# Altium schematic sheet AFE_Buffer.SchDoc: Shuttler
size 420 x 297 mm; Author: G.Kasprowicz; CompanyName: WUT ISE; DrawnBy: G.Kasprowicz; Organization: WUT ISE; Address1: PW ISE; Address2: Nowowiejska 15/19 00-665 Warsaw; Address3: gkasprow@gmail.com; DocumentNumber: 2; SheetNumber: 2; SheetTotal: 10; ModifiedBy: -; CheckedDate: -; Title2: AFE control buffers; DivGrp: WUT ISE; Designer: G.Kasprowicz; ModifiedDate: -; ProjectName: Sensor Box
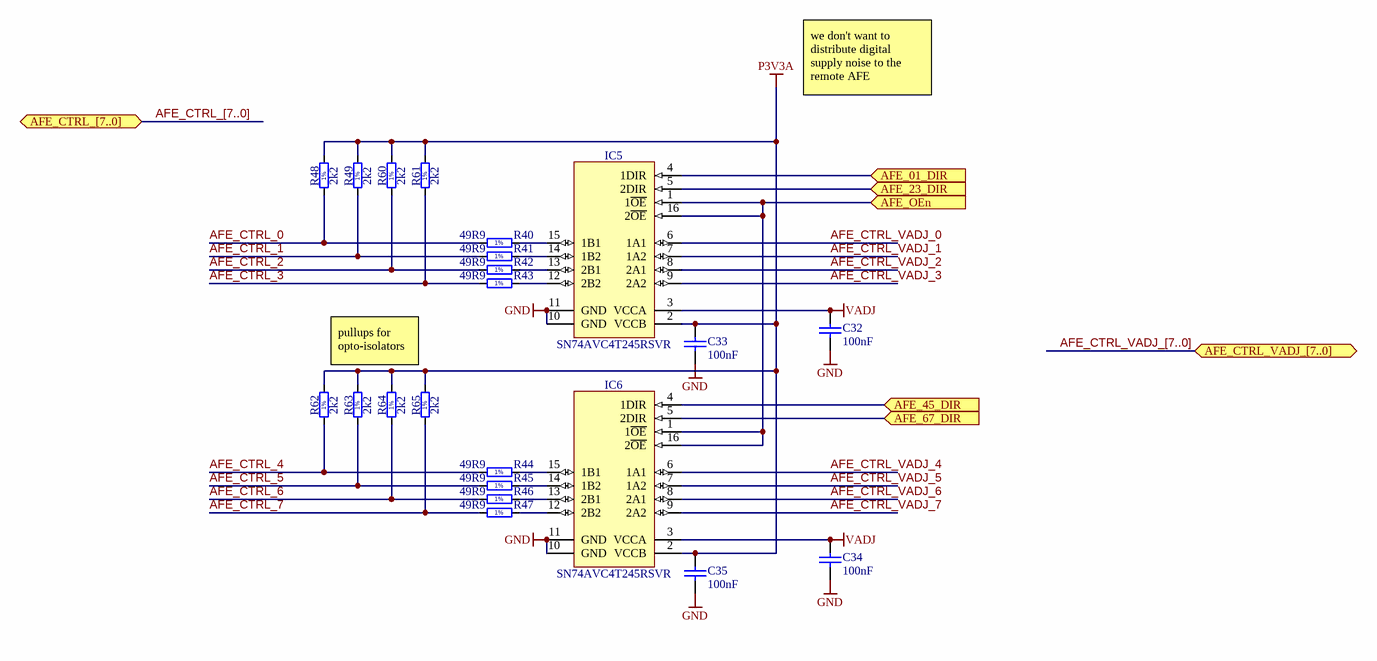
[diagram p0: AFE_Buffer.SchDoc]

## Parts
C32  100nF  [CAPC1005X55N]
C33  100nF  [CAPC1005X55N]
C34  100nF  [CAPC1005X55N]
C35  100nF  [CAPC1005X55N]
IC5  SN74AVC4T245RSVR  [QFN40P180X260X55-16N]
IC6  SN74AVC4T245RSVR  [QFN40P180X260X55-16N]
R40  49R9  [RESC1005X40N]
R41  49R9  [RESC1005X40N]
R42  49R9  [RESC1005X40N]
R43  49R9  [RESC1005X40N]
R44  49R9  [RESC1005X40N]
R45  49R9  [RESC1005X40N]
R46  49R9  [RESC1005X40N]
R47  49R9  [RESC1005X40N]
R48  2k2  [RESC1005X40N]
R49  2k2  [RESC1005X40N]
R60  2k2  [RESC1005X40N]
R61  2k2  [RESC1005X40N]
R62  2k2  [RESC1005X40N]
R63  2k2  [RESC1005X40N]
R64  2k2  [RESC1005X40N]
R65  2k2  [RESC1005X40N]

## Ports
AFE_01_DIR (in), AFE_23_DIR (in), AFE_45_DIR (in), AFE_67_DIR (in), AFE_CTRL_[7..0] (bidir), AFE_CTRL_VADJ_[7..0] (bidir), AFE_OEn (in)

## Nets
GND: C32.1 C33.1 C34.1 C35.1 IC5.10(GND) IC5.11(GND) IC6.10(GND) IC6.11(GND)
P3V3A: C33.2 C35.2 IC5.2(VCCB) IC6.2(VCCB) R48.2 R49.2 R60.2 R61.2 R62.2 R63.2 R64.2 R65.2
VADJ: C32.2 C34.2 IC5.3(VCCA) IC6.3(VCCA)
AFE_01_DIR: IC5.4(1DIR) ; port AFE_01_DIR
AFE_23_DIR: IC5.5(2DIR) ; port AFE_23_DIR
AFE_45_DIR: IC6.4(1DIR) ; port AFE_45_DIR
AFE_67_DIR: IC6.5(2DIR) ; port AFE_67_DIR
AFE_CTRL_0: R40.1 R48.1
AFE_CTRL_1: R41.1 R49.1
AFE_CTRL_2: R42.1 R60.1
AFE_CTRL_3: R43.1 R61.1
AFE_CTRL_4: R44.1 R62.1
AFE_CTRL_5: R45.1 R63.1
AFE_CTRL_6: R46.1 R64.1
AFE_CTRL_7: R47.1 R65.1
AFE_CTRL_VADJ_0: IC5.6(1A1)
AFE_CTRL_VADJ_1: IC5.7(1A2)
AFE_CTRL_VADJ_2: IC5.8(2A1)
AFE_CTRL_VADJ_3: IC5.9(2A2)
AFE_CTRL_VADJ_4: IC6.6(1A1)
AFE_CTRL_VADJ_5: IC6.7(1A2)
AFE_CTRL_VADJ_6: IC6.8(2A1)
AFE_CTRL_VADJ_7: IC6.9(2A2)
AFE_OEn: IC5.1(1~{OE}) IC5.16(2~{OE}) IC6.1(1~{OE}) IC6.16(2~{OE}) ; port AFE_OEn
NetIC5_12: IC5.12(2B2) R43.2
NetIC5_13: IC5.13(2B1) R42.2
NetIC5_14: IC5.14(1B2) R41.2
NetIC5_15: IC5.15(1B1) R40.2
NetIC6_12: IC6.12(2B2) R47.2
NetIC6_13: IC6.13(2B1) R46.2
NetIC6_14: IC6.14(1B2) R45.2
NetIC6_15: IC6.15(1B1) R44.2

## Buses and harness runs
bus AFE_CTRL_[7..0] = port AFE_CTRL_[7..0]
bus AFE_CTRL_VADJ_[7..0] = port AFE_CTRL_VADJ_[7..0]

## Notes on the sheet
- we don't want to distribute digital supply noise to the remote AFE
- pullups for opto-isolators
- Project/Equipment
- Document
- Designer
- Drawn by
- Check.by
- Copyright WUT ISE 2020.
  This documentation describes Open Hardware and is licensed under the CERN OHL v.1.2. You may redistribute and modify this documentation under the terms of the CERN OHL v.1.2. (http://ohwr.org/CERNOHL). This documentation is distributed WITHOUT ANY EXPRESS OR IMPLIED WARRANTY, INCLUDING OF MERCHANTABILITY, SATISFACTORY QUALITY AND FITNESS FOR A PARTICULAR PURPOSE. Please see the CERN OHL v.1.2 for applicable conditions.
- Contact
- File
- Last Mod.
- Print Date
- Sheet
- Size
- A3
- of
- Rev
- (in symbol R0402_2K2_1%_0.0625W_100PPM) 1%
- (in symbol R0402_49R9_1%_0.0625W_100PPM) 1%

## Library data of the parts
C32-C35 = CC0402_100NF_16V_10%_X5R: Non-polarised capacitor; Part Description: SMD Multilayer Chip Ceramic Capacitor; Manufacturer: GENERIC; Manufacturer1 Part Number: GRM155R61C104KA88D; Voltage: 16V; TC: X5R; Tolerance: ±10%; Part Number: CC0402_100NF_16V_10%_X5R; Component Kind: Standard; Component Type: Standard; Pin Count: 2; Value: 100nF; Status: None; Manufacturer Part Number: CC0402_100NF_16V_10%_X5R; Case: 0402; Mounted: Yes; Socket: No; SMD: Yes; Sense: No; Manufacturer1 Example: MURATA; Manufacturer1 ComponentHeight: 0.55mm; HelpURL: \\cern.ch\dfs\Applications\Altium\Datasheets\CC0402_X5R_MURATA_GRM.pdf; Author: CERN DEM JLC; CreateDate: 10.12.2013; LatestRevisionDate: 10.12.2013
IC5 IC6 = SN74AVC4T245RSVR: 4-Bit Dual-Supply Bus Transceiver with Configurable Voltage Translation and 3-State Output; Part Description: 4-Bit Dual-Supply Bus Transceiver With Configurable Voltage Translation and 3-State Outputs; Manufacturer: TEXAS INSTRUMENTS; PressFit: No; Bonding: No; Part Number: SN74AVC4T245RSVR; Component Kind: Standard; Component Type: Standard; Device: SN74AVC4T245RSVR; PackageDescription: QFN, 0.40mm Pitch, Rect.; 16 Pin, 2.60mm L X 1.80mm W X 0.55mm H Body, IPC Medium Density; Status: Not Recommended; Manufacturer Part Number: SN74AVC4T245RSVR; Pin Count: 16; Case: QFN16; Mounted: Yes; Socket: No; SMD: Yes; Sense: No; ComponentHeight: 0.55mm; Author: CERN DEM JLC; HelpURL: \\cern.ch\dfs\Applications\Altium\Datasheets\SN74AVC4T245RSVR.pdf; CreateDate: 08/07/2014; LatestRevisionDate: 30/03/2017
R40-R47 = R0402_49R9_1%_0.0625W_100PPM: Resistor - 1%; Part Description: General Purpose Thick Film Chip Resistor; Manufacturer: GENERIC; Manufacturer1 Part Number: 232270674999L or RC0402FR-0749R9L; TC: ±100ppm/°C; PressFit: No; Part Number: R0402_49R9_1%_0.0625W_100PPM; Component Kind: Standard; Component Type: Standard; Pin Count: 2; Value: 49R9; Status: Not Recommended; Power: 0.0625W; Tolerance: ±1%; Manufacturer Part Number: R0402_49R9_1%_0.0625W_100PPM; Case: 0402; Mounted: Yes; Sense: No; Socket: No; SMD: Yes; Manufacturer1 Example: YAGEO PHYCOMP; Manufacturer1 ComponentHeight: 0.4mm; HelpURL: \\cern.ch\dfs\Applications\Altium\Datasheets\R0402_Phycomp_RC0402.pdf; Author: CERN DEM JLC; CreateDate: 24.10.2012; LatestRevisionDate: 24.10.2012
R48 R49 R60-R65 = R0402_2K2_1%_0.0625W_100PPM: Resistor - 1%; Part Description: General Purpose Thick Film Chip Resistor; Manufacturer: GENERIC; Manufacturer1 Part Number: 232270672202L; TC: ±100ppm/°C; PressFit: No; Part Number: R0402_2K2_1%_0.0625W_100PPM; Component Kind: Standard; Component Type: Standard; Pin Count: 2; Value: 2k2; Status: Not Recommended; Power: 0.0625W; Tolerance: ±1%; Manufacturer Part Number: R0402_2K2_1%_0.0625W_100PPM; Case: 0402; Mounted: Yes; Sense: No; Socket: No; SMD: Yes; Manufacturer1 Example: YAGEO PHYCOMP; Manufacturer1 ComponentHeight: 0.4mm; HelpURL: \\cern.ch\dfs\Applications\Altium\Datasheets\R0402_Phycomp_RC0402.pdf; Author: CERN DEM JLC; CreateDate: 03.12.2007; LatestRevisionDate: 17.10.2012